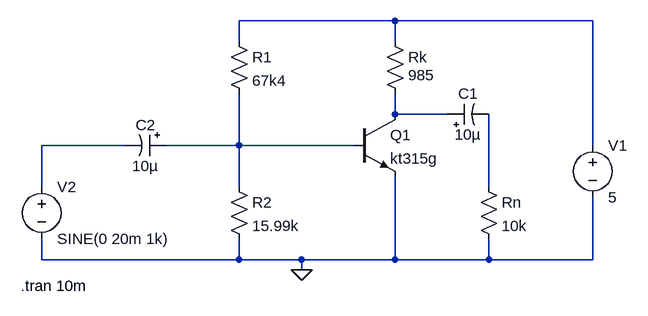
[diagram p0: schematic simulation.asc]
simulation.asc, the LTspice schematic file:
Version 4
SHEET 1 880 680
WIRE 368 -48 128 -48
WIRE 672 -48 368 -48
WIRE 128 -16 128 -48
WIRE 368 -16 368 -48
WIRE 368 96 368 64
WIRE 448 96 368 96
WIRE -48 144 -176 144
WIRE 128 144 128 64
WIRE 128 144 16 144
WIRE 304 144 128 144
WIRE 672 144 672 -48
WIRE -176 208 -176 144
WIRE 128 208 128 144
WIRE 512 208 512 96
WIRE -176 320 -176 288
WIRE 128 320 128 288
WIRE 128 320 -176 320
WIRE 224 320 128 320
WIRE 368 320 368 192
WIRE 368 320 224 320
WIRE 512 320 512 288
WIRE 512 320 368 320
WIRE 672 320 672 224
WIRE 672 320 512 320
WIRE 224 336 224 320
FLAG 224 336 0
SYMBOL res 112 -32 R0
SYMATTR InstName R1
SYMATTR Value 67k4
SYMBOL res 112 192 R0
SYMATTR InstName R2
SYMATTR Value 15.99k
SYMBOL res 352 -32 R0
WINDOW 3 36 68 Left 2
SYMATTR InstName Rk
SYMATTR Value 985
SYMBOL res 496 192 R0
SYMATTR InstName Rn
SYMATTR Value 10k
SYMBOL voltage 672 128 R0
WINDOW 123 0 0 Left 2
WINDOW 39 0 0 Left 2
SYMATTR InstName V1
SYMATTR Value 5
SYMBOL voltage -176 192 R0
WINDOW 123 0 0 Left 2
WINDOW 39 0 0 Left 2
SYMATTR InstName V2
SYMATTR Value SINE(0 20m 1k)
SYMBOL polcap 448 112 R270
WINDOW 0 32 32 VTop 2
WINDOW 3 0 32 VBottom 2
SYMATTR InstName C1
SYMATTR Value 10µ
SYMBOL polcap 16 128 R90
WINDOW 0 0 32 VBottom 2
WINDOW 3 32 32 VTop 2
SYMATTR InstName C2
SYMATTR Value 10µ
SYMBOL npn 304 96 R0
SYMATTR InstName Q1
SYMATTR Value kt315g
TEXT -208 360 Left 2 !.tran 10m

The netlist it stands for:
* simulation.asc
R1 N001 N004 67k4
R2 N004 0 15.99k
Rk N001 N002 985
Rn N005 0 10k
V1 N001 0 5
V2 N003 0 SINE(0 20m 1k)
C1 N002 N005 10µ
C2 N004 N003 10µ
Q1 N002 N004 0 0 kt315g
.model NPN NPN
.model PNP PNP
.lib standard.bjt
.tran 10m
.backanno
.end